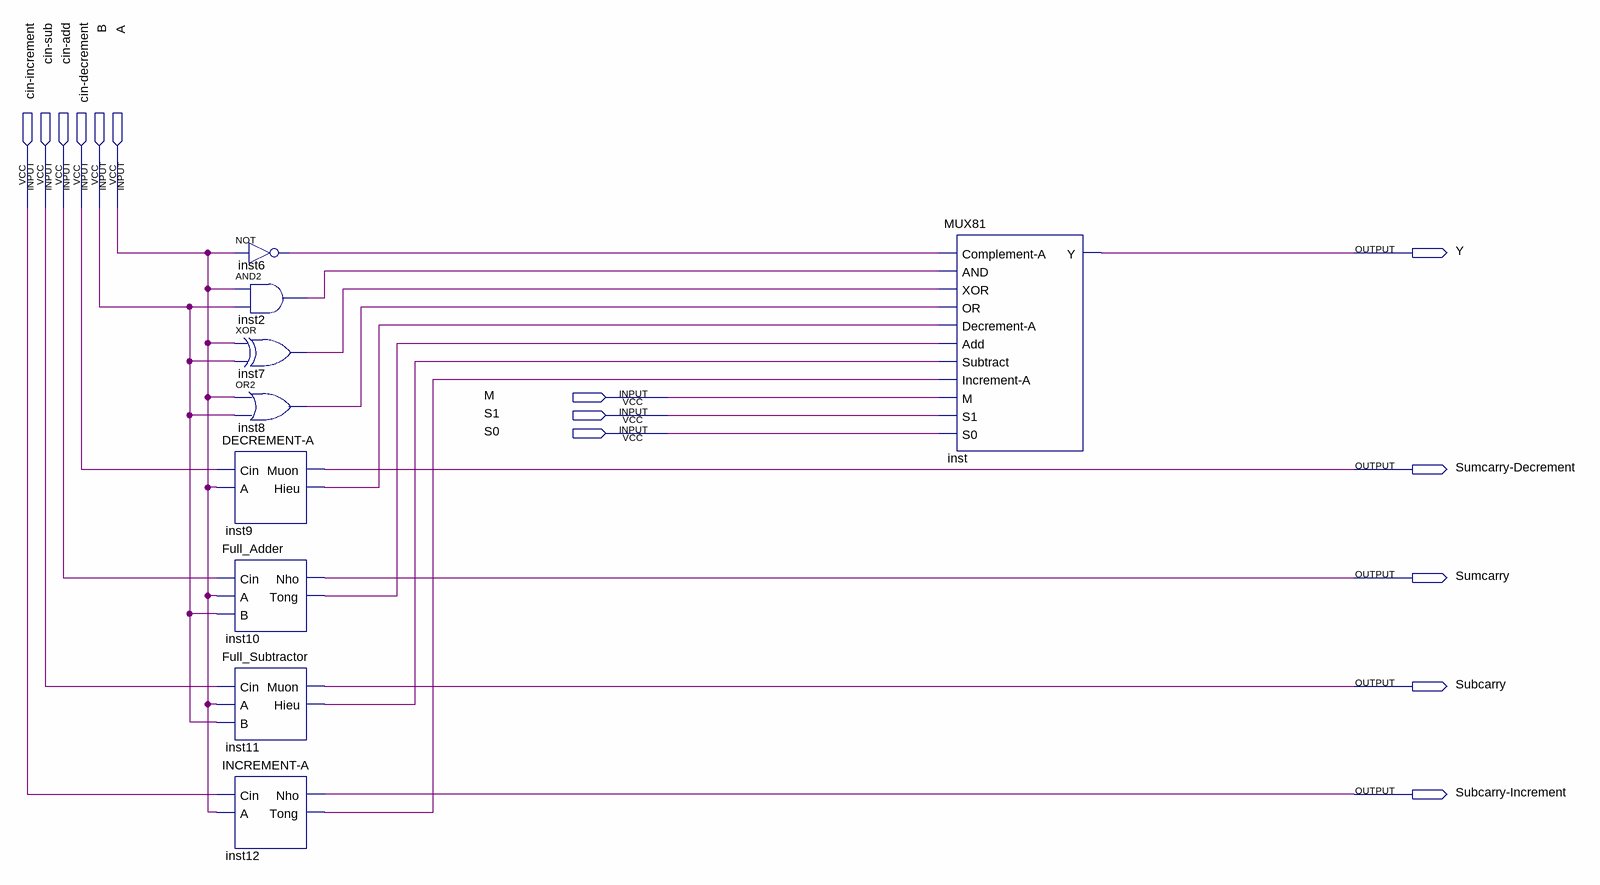
[diagram p0: schematic sheet]
// Quartus schematic ALU-1BIT.bdf as structural Verilog: 9 symbols, 14 pins
module \ALU-1BIT  (
  input  \cin-increment ,
  input  \cin-sub ,
  input  \cin-add ,
  input  \cin-decrement ,
  input  B,
  input  A,
  input  M,
  input  S1,
  input  S0,
  output Y,
  output \Sumcarry-Decrement ,
  output Sumcarry,
  output Subcarry,
  output \Subcarry-Increment 
);

  wire inst2_out, inst6_out, inst7_out, inst8_out, inst9_hieu, inst10_tong, inst11_hieu, inst12_tong;

  not inst6 (inst6_out, A);
  and inst2 (inst2_out, A, B);
  xor inst7 (inst7_out, A, B);
  or inst8 (inst8_out, A, B);
  \DECREMENT-A  inst9 (.Cin(\cin-decrement ), .A(A), .Muon(\Sumcarry-Decrement ), .Hieu(inst9_hieu));
  Full_Adder inst10 (.Cin(\cin-add ), .A(A), .B(B), .Nho(Sumcarry), .Tong(inst10_tong));
  Full_Subtractor inst11 (.Cin(\cin-sub ), .A(A), .B(B), .Muon(Subcarry), .Hieu(inst11_hieu));
  \INCREMENT-A  inst12 (.Cin(\cin-increment ), .A(A), .Nho(\Subcarry-Increment ), .Tong(inst12_tong));
  MUX81 inst (
    .\Complement-A (inst6_out), .AND(inst2_out), .XOR(inst7_out), .OR(inst8_out), .\Decrement-A (inst9_hieu),
    .Add(inst10_tong), .Subtract(inst11_hieu), .\Increment-A (inst12_tong), .M(M), .S1(S1), .S0(S0), .Y(Y));
endmodule
